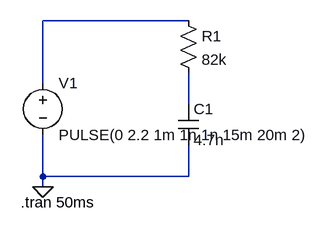
[diagram p0: schematic Lab3_Part1.asc]
Lab3_Part1.asc, the LTspice schematic file:
Version 4
SHEET 1 880 680
WIRE 192 48 -32 48
WIRE -32 144 -32 48
WIRE 192 176 192 128
WIRE -32 288 -32 224
WIRE 192 288 192 240
WIRE 192 288 -32 288
WIRE -32 304 -32 288
FLAG -32 304 0
SYMBOL voltage -32 128 R0
WINDOW 123 0 0 Left 0
WINDOW 39 0 0 Left 0
SYMATTR InstName V1
SYMATTR Value PULSE(0 2.2 1m 1n 1n 15m 20m 2)
SYMBOL res 176 32 R0
SYMATTR InstName R1
SYMATTR Value 82k
SYMBOL cap 176 176 R0
SYMATTR InstName C1
SYMATTR Value 4.7n
TEXT -66 328 Left 2 !.tran 50ms

The netlist it stands for:
* Lab3_Part1.asc
V1 N001 0 PULSE(0 2.2 1m 1n 1n 15m 20m 2)
R1 N001 N002 82k
C1 N002 0 4.7n
.tran 50ms
.backanno
.end